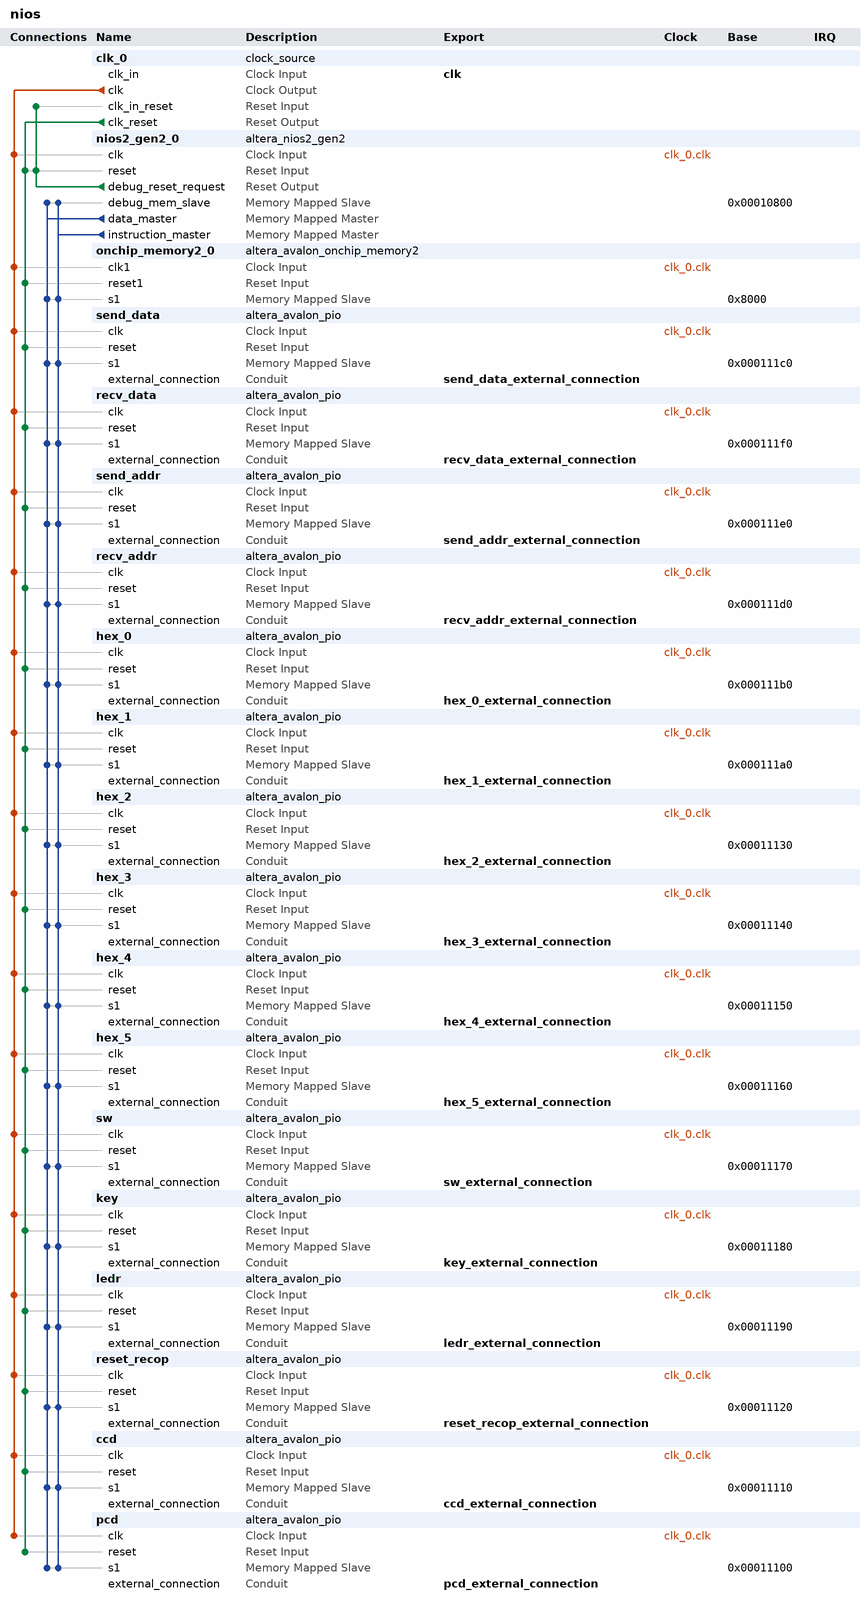
[diagram p0: system contents]
# Platform Designer (Qsys) system nios, Cyclone V 5CSEMA5F31C6
# Parameters at their usual value, and those the tool derives, are not listed.
package require -exact qsys 18.1
create_system nios
set_project_property DEVICE_FAMILY {Cyclone V}
set_project_property DEVICE 5CSEMA5F31C6

add_instance clk_0 clock_source 18.1
set_instance_parameter_value clk_0 clockFrequency 50000000

add_instance nios2_gen2_0 altera_nios2_gen2 18.1
set_instance_parameter_value nios2_gen2_0 dcache_size 8192
set_instance_parameter_value nios2_gen2_0 exceptionSlave onchip_memory2_0.s1
set_instance_parameter_value nios2_gen2_0 icache_size 8192
set_instance_parameter_value nios2_gen2_0 impl Fast
set_instance_parameter_value nios2_gen2_0 resetSlave onchip_memory2_0.s1

add_instance onchip_memory2_0 altera_avalon_onchip_memory2 18.1
set_instance_parameter_value onchip_memory2_0 dataWidth 32
set_instance_parameter_value onchip_memory2_0 dualPort false
set_instance_parameter_value onchip_memory2_0 initMemContent true
set_instance_parameter_value onchip_memory2_0 initializationFileName onchip_mem.hex
set_instance_parameter_value onchip_memory2_0 memorySize 20480

add_instance send_data altera_avalon_pio 18.1
set_instance_parameter_value send_data direction Output
set_instance_parameter_value send_data width 32

add_instance recv_data altera_avalon_pio 18.1
set_instance_parameter_value recv_data direction Input
set_instance_parameter_value recv_data width 32

add_instance send_addr altera_avalon_pio 18.1
set_instance_parameter_value send_addr direction Output
set_instance_parameter_value send_addr width 8

add_instance recv_addr altera_avalon_pio 18.1
set_instance_parameter_value recv_addr direction Input
set_instance_parameter_value recv_addr width 8

add_instance hex_0 altera_avalon_pio 18.1
set_instance_parameter_value hex_0 direction Output
set_instance_parameter_value hex_0 width 7

add_instance hex_1 altera_avalon_pio 18.1
set_instance_parameter_value hex_1 direction Output
set_instance_parameter_value hex_1 width 7

add_instance hex_2 altera_avalon_pio 18.1
set_instance_parameter_value hex_2 direction Output
set_instance_parameter_value hex_2 width 7

add_instance hex_3 altera_avalon_pio 18.1
set_instance_parameter_value hex_3 direction Output
set_instance_parameter_value hex_3 width 7

add_instance hex_4 altera_avalon_pio 18.1
set_instance_parameter_value hex_4 direction Output
set_instance_parameter_value hex_4 width 7

add_instance hex_5 altera_avalon_pio 18.1
set_instance_parameter_value hex_5 direction Output
set_instance_parameter_value hex_5 width 7

add_instance sw altera_avalon_pio 18.1
set_instance_parameter_value sw direction Input
set_instance_parameter_value sw width 10

add_instance key altera_avalon_pio 18.1
set_instance_parameter_value key direction Input
set_instance_parameter_value key width 4

add_instance ledr altera_avalon_pio 18.1
set_instance_parameter_value ledr direction Output
set_instance_parameter_value ledr width 10

add_instance reset_recop altera_avalon_pio 18.1
set_instance_parameter_value reset_recop direction Output
set_instance_parameter_value reset_recop width 1

add_instance ccd altera_avalon_pio 18.1
set_instance_parameter_value ccd direction Input
set_instance_parameter_value ccd width 4

add_instance pcd altera_avalon_pio 18.1
set_instance_parameter_value pcd direction Input
set_instance_parameter_value pcd width 4

# connections
add_connection clk_0.clk ccd.clk clock
add_connection clk_0.clk hex_0.clk clock
add_connection clk_0.clk hex_1.clk clock
add_connection clk_0.clk hex_2.clk clock
add_connection clk_0.clk hex_3.clk clock
add_connection clk_0.clk hex_4.clk clock
add_connection clk_0.clk hex_5.clk clock
add_connection clk_0.clk key.clk clock
add_connection clk_0.clk ledr.clk clock
add_connection clk_0.clk nios2_gen2_0.clk clock
add_connection clk_0.clk onchip_memory2_0.clk1 clock
add_connection clk_0.clk pcd.clk clock
add_connection clk_0.clk recv_addr.clk clock
add_connection clk_0.clk recv_data.clk clock
add_connection clk_0.clk reset_recop.clk clock
add_connection clk_0.clk send_addr.clk clock
add_connection clk_0.clk send_data.clk clock
add_connection clk_0.clk sw.clk clock
add_connection clk_0.clk_reset ccd.reset reset
add_connection clk_0.clk_reset hex_0.reset reset
add_connection clk_0.clk_reset hex_1.reset reset
add_connection clk_0.clk_reset hex_2.reset reset
add_connection clk_0.clk_reset hex_3.reset reset
add_connection clk_0.clk_reset hex_4.reset reset
add_connection clk_0.clk_reset hex_5.reset reset
add_connection clk_0.clk_reset key.reset reset
add_connection clk_0.clk_reset ledr.reset reset
add_connection clk_0.clk_reset nios2_gen2_0.reset reset
add_connection clk_0.clk_reset onchip_memory2_0.reset1 reset
add_connection clk_0.clk_reset pcd.reset reset
add_connection clk_0.clk_reset recv_addr.reset reset
add_connection clk_0.clk_reset recv_data.reset reset
add_connection clk_0.clk_reset reset_recop.reset reset
add_connection clk_0.clk_reset send_addr.reset reset
add_connection clk_0.clk_reset send_data.reset reset
add_connection clk_0.clk_reset sw.reset reset
add_connection nios2_gen2_0.debug_reset_request clk_0.clk_in_reset reset
add_connection nios2_gen2_0.debug_reset_request nios2_gen2_0.reset reset
add_connection nios2_gen2_0.data_master ccd.s1 avalon
set_connection_parameter_value nios2_gen2_0.data_master/ccd.s1 baseAddress 0x00011110
add_connection nios2_gen2_0.data_master hex_0.s1 avalon
set_connection_parameter_value nios2_gen2_0.data_master/hex_0.s1 baseAddress 0x000111b0
add_connection nios2_gen2_0.data_master hex_1.s1 avalon
set_connection_parameter_value nios2_gen2_0.data_master/hex_1.s1 baseAddress 0x000111a0
add_connection nios2_gen2_0.data_master hex_2.s1 avalon
set_connection_parameter_value nios2_gen2_0.data_master/hex_2.s1 baseAddress 0x00011130
add_connection nios2_gen2_0.data_master hex_3.s1 avalon
set_connection_parameter_value nios2_gen2_0.data_master/hex_3.s1 baseAddress 0x00011140
add_connection nios2_gen2_0.data_master hex_4.s1 avalon
set_connection_parameter_value nios2_gen2_0.data_master/hex_4.s1 baseAddress 0x00011150
add_connection nios2_gen2_0.data_master hex_5.s1 avalon
set_connection_parameter_value nios2_gen2_0.data_master/hex_5.s1 baseAddress 0x00011160
add_connection nios2_gen2_0.data_master key.s1 avalon
set_connection_parameter_value nios2_gen2_0.data_master/key.s1 baseAddress 0x00011180
add_connection nios2_gen2_0.data_master ledr.s1 avalon
set_connection_parameter_value nios2_gen2_0.data_master/ledr.s1 baseAddress 0x00011190
add_connection nios2_gen2_0.data_master nios2_gen2_0.debug_mem_slave avalon
set_connection_parameter_value nios2_gen2_0.data_master/nios2_gen2_0.debug_mem_slave baseAddress 0x00010800
add_connection nios2_gen2_0.data_master onchip_memory2_0.s1 avalon
set_connection_parameter_value nios2_gen2_0.data_master/onchip_memory2_0.s1 baseAddress 0x8000
add_connection nios2_gen2_0.data_master pcd.s1 avalon
set_connection_parameter_value nios2_gen2_0.data_master/pcd.s1 baseAddress 0x00011100
add_connection nios2_gen2_0.data_master recv_addr.s1 avalon
set_connection_parameter_value nios2_gen2_0.data_master/recv_addr.s1 baseAddress 0x000111d0
add_connection nios2_gen2_0.data_master recv_data.s1 avalon
set_connection_parameter_value nios2_gen2_0.data_master/recv_data.s1 baseAddress 0x000111f0
add_connection nios2_gen2_0.data_master reset_recop.s1 avalon
set_connection_parameter_value nios2_gen2_0.data_master/reset_recop.s1 baseAddress 0x00011120
add_connection nios2_gen2_0.data_master send_addr.s1 avalon
set_connection_parameter_value nios2_gen2_0.data_master/send_addr.s1 baseAddress 0x000111e0
add_connection nios2_gen2_0.data_master send_data.s1 avalon
set_connection_parameter_value nios2_gen2_0.data_master/send_data.s1 baseAddress 0x000111c0
add_connection nios2_gen2_0.data_master sw.s1 avalon
set_connection_parameter_value nios2_gen2_0.data_master/sw.s1 baseAddress 0x00011170
add_connection nios2_gen2_0.instruction_master ccd.s1 avalon
set_connection_parameter_value nios2_gen2_0.instruction_master/ccd.s1 baseAddress 0x00011110
add_connection nios2_gen2_0.instruction_master hex_0.s1 avalon
set_connection_parameter_value nios2_gen2_0.instruction_master/hex_0.s1 baseAddress 0x000111b0
add_connection nios2_gen2_0.instruction_master hex_1.s1 avalon
set_connection_parameter_value nios2_gen2_0.instruction_master/hex_1.s1 baseAddress 0x000111a0
add_connection nios2_gen2_0.instruction_master hex_2.s1 avalon
set_connection_parameter_value nios2_gen2_0.instruction_master/hex_2.s1 baseAddress 0x00011130
add_connection nios2_gen2_0.instruction_master hex_3.s1 avalon
set_connection_parameter_value nios2_gen2_0.instruction_master/hex_3.s1 baseAddress 0x00011140
add_connection nios2_gen2_0.instruction_master hex_4.s1 avalon
set_connection_parameter_value nios2_gen2_0.instruction_master/hex_4.s1 baseAddress 0x00011150
add_connection nios2_gen2_0.instruction_master hex_5.s1 avalon
set_connection_parameter_value nios2_gen2_0.instruction_master/hex_5.s1 baseAddress 0x00011160
add_connection nios2_gen2_0.instruction_master key.s1 avalon
set_connection_parameter_value nios2_gen2_0.instruction_master/key.s1 baseAddress 0x00011180
add_connection nios2_gen2_0.instruction_master ledr.s1 avalon
set_connection_parameter_value nios2_gen2_0.instruction_master/ledr.s1 baseAddress 0x00011190
add_connection nios2_gen2_0.instruction_master nios2_gen2_0.debug_mem_slave avalon
set_connection_parameter_value nios2_gen2_0.instruction_master/nios2_gen2_0.debug_mem_slave baseAddress 0x00010800
add_connection nios2_gen2_0.instruction_master onchip_memory2_0.s1 avalon
set_connection_parameter_value nios2_gen2_0.instruction_master/onchip_memory2_0.s1 baseAddress 0x8000
add_connection nios2_gen2_0.instruction_master pcd.s1 avalon
set_connection_parameter_value nios2_gen2_0.instruction_master/pcd.s1 baseAddress 0x00011100
add_connection nios2_gen2_0.instruction_master recv_addr.s1 avalon
set_connection_parameter_value nios2_gen2_0.instruction_master/recv_addr.s1 baseAddress 0x000111d0
add_connection nios2_gen2_0.instruction_master recv_data.s1 avalon
set_connection_parameter_value nios2_gen2_0.instruction_master/recv_data.s1 baseAddress 0x000111f0
add_connection nios2_gen2_0.instruction_master reset_recop.s1 avalon
set_connection_parameter_value nios2_gen2_0.instruction_master/reset_recop.s1 baseAddress 0x00011120
add_connection nios2_gen2_0.instruction_master send_addr.s1 avalon
set_connection_parameter_value nios2_gen2_0.instruction_master/send_addr.s1 baseAddress 0x000111e0
add_connection nios2_gen2_0.instruction_master send_data.s1 avalon
set_connection_parameter_value nios2_gen2_0.instruction_master/send_data.s1 baseAddress 0x000111c0
add_connection nios2_gen2_0.instruction_master sw.s1 avalon
set_connection_parameter_value nios2_gen2_0.instruction_master/sw.s1 baseAddress 0x00011170

# exported interfaces
add_interface ccd_external_connection conduit end
set_interface_property ccd_external_connection EXPORT_OF ccd.external_connection
add_interface clk clock sink
set_interface_property clk EXPORT_OF clk_0.clk_in
add_interface hex_0_external_connection conduit end
set_interface_property hex_0_external_connection EXPORT_OF hex_0.external_connection
add_interface hex_1_external_connection conduit end
set_interface_property hex_1_external_connection EXPORT_OF hex_1.external_connection
add_interface hex_2_external_connection conduit end
set_interface_property hex_2_external_connection EXPORT_OF hex_2.external_connection
add_interface hex_3_external_connection conduit end
set_interface_property hex_3_external_connection EXPORT_OF hex_3.external_connection
add_interface hex_4_external_connection conduit end
set_interface_property hex_4_external_connection EXPORT_OF hex_4.external_connection
add_interface hex_5_external_connection conduit end
set_interface_property hex_5_external_connection EXPORT_OF hex_5.external_connection
add_interface key_external_connection conduit end
set_interface_property key_external_connection EXPORT_OF key.external_connection
add_interface ledr_external_connection conduit end
set_interface_property ledr_external_connection EXPORT_OF ledr.external_connection
add_interface pcd_external_connection conduit end
set_interface_property pcd_external_connection EXPORT_OF pcd.external_connection
add_interface recv_addr_external_connection conduit end
set_interface_property recv_addr_external_connection EXPORT_OF recv_addr.external_connection
add_interface recv_data_external_connection conduit end
set_interface_property recv_data_external_connection EXPORT_OF recv_data.external_connection
add_interface reset_recop_external_connection conduit end
set_interface_property reset_recop_external_connection EXPORT_OF reset_recop.external_connection
add_interface send_addr_external_connection conduit end
set_interface_property send_addr_external_connection EXPORT_OF send_addr.external_connection
add_interface send_data_external_connection conduit end
set_interface_property send_data_external_connection EXPORT_OF send_data.external_connection
add_interface sw_external_connection conduit end
set_interface_property sw_external_connection EXPORT_OF sw.external_connection

set_interconnect_requirement {$system} qsys_mm.clockCrossingAdapter HANDSHAKE
set_interconnect_requirement {$system} qsys_mm.enableEccProtection FALSE
set_interconnect_requirement {$system} qsys_mm.insertDefaultSlave FALSE
set_interconnect_requirement {$system} qsys_mm.maxAdditionalLatency 1

save_system nios.qsys
